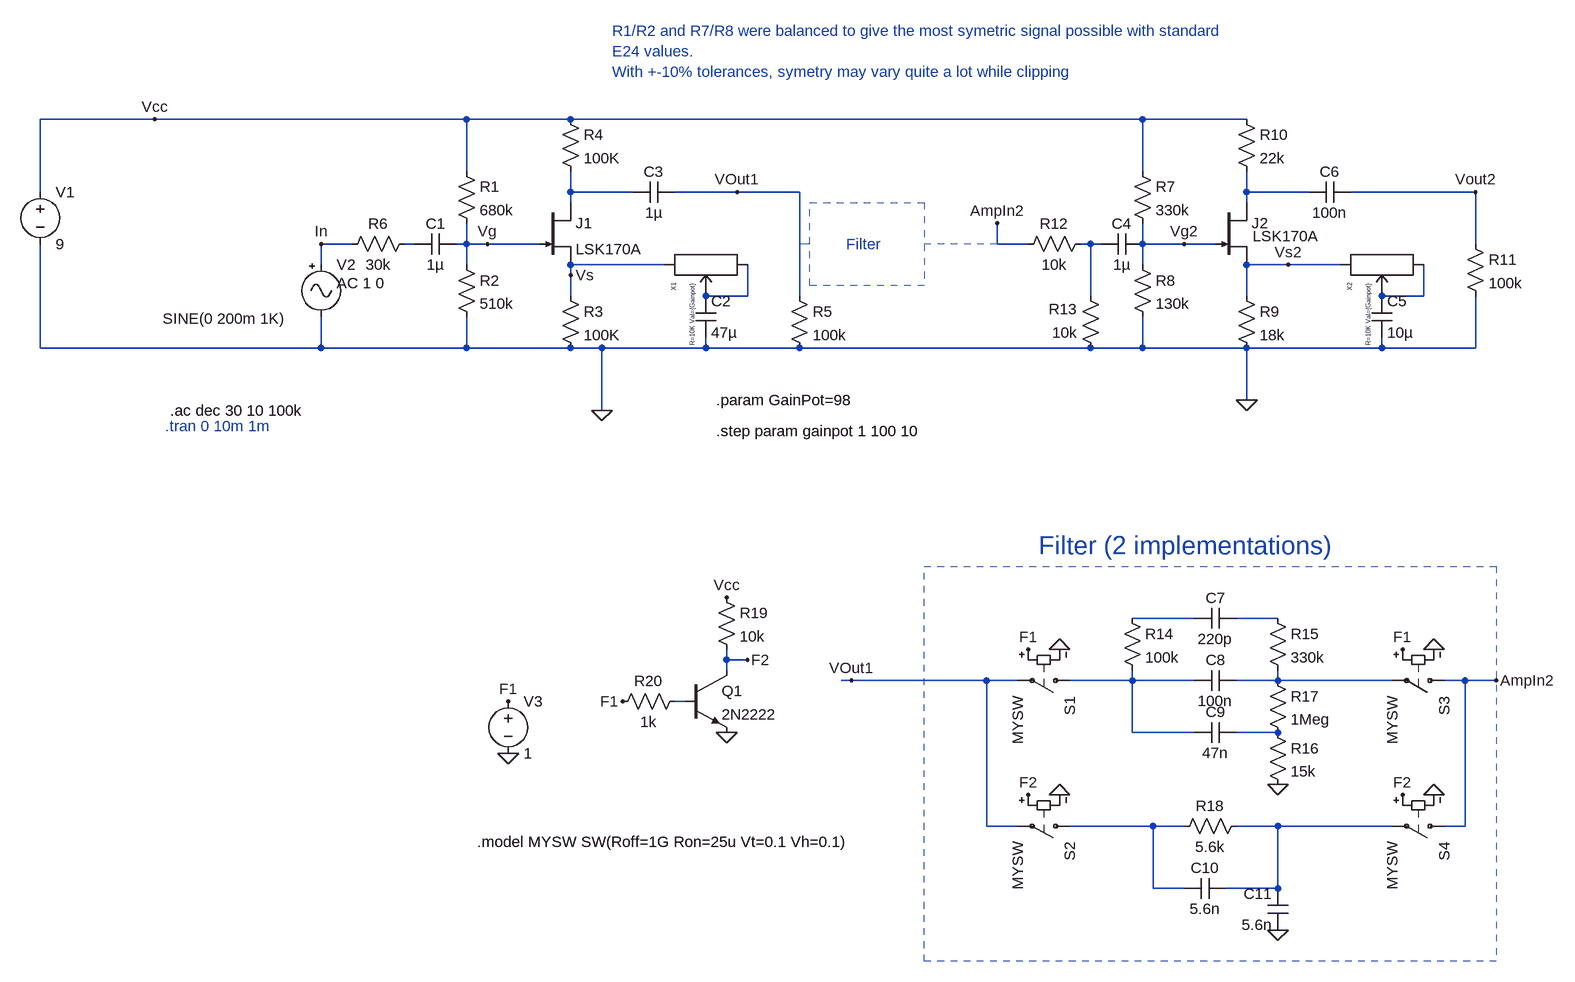
[diagram p0: schematic NJfetCommonSourceAmp.asc]
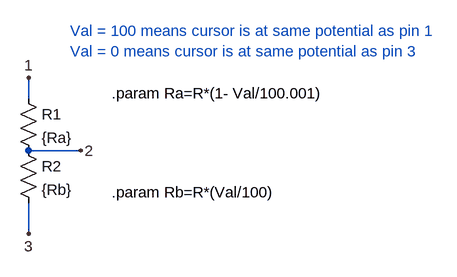
[diagram p1: sub-circuit potentiometer.asc]
NJfetCommonSourceAmp.asc, the LTspice schematic file:
Version 4
SHEET 1 1916 1204
WIRE -256 -96 -432 -96
WIRE 224 -96 -256 -96
WIRE 384 -96 224 -96
WIRE 1264 -96 384 -96
WIRE 1424 -96 1264 -96
WIRE 224 -16 224 -96
WIRE 1264 -16 1264 -96
WIRE -432 16 -432 -96
WIRE 384 16 384 -16
WIRE 480 16 384 16
WIRE 640 16 544 16
WIRE 736 16 640 16
WIRE 1424 16 1424 -16
WIRE 1520 16 1424 16
WIRE 1776 16 1584 16
WIRE 384 32 384 16
WIRE 1424 32 1424 16
WIRE 48 96 0 96
WIRE 144 96 128 96
WIRE 224 96 224 64
WIRE 224 96 208 96
WIRE 256 96 224 96
WIRE 336 96 256 96
WIRE 1040 96 1040 64
WIRE 1088 96 1040 96
WIRE 1184 96 1168 96
WIRE 1200 96 1184 96
WIRE 1264 96 1264 64
WIRE 1328 96 1264 96
WIRE 1376 96 1328 96
WIRE 1776 96 1776 16
WIRE 0 128 0 96
WIRE 224 128 224 96
WIRE 528 128 384 128
WIRE 1264 128 1264 96
WIRE 1488 128 1424 128
WIRE 1568 128 1488 128
WIRE 384 144 384 128
WIRE 384 176 384 144
WIRE 656 176 656 128
WIRE 656 176 592 176
WIRE 736 176 736 16
WIRE 1184 176 1184 96
WIRE 1424 176 1424 128
WIRE 1696 176 1696 128
WIRE 1696 176 1632 176
WIRE -432 256 -432 96
WIRE 0 256 0 208
WIRE 0 256 -432 256
WIRE 224 256 224 208
WIRE 224 256 0 256
WIRE 384 256 224 256
WIRE 432 256 384 256
WIRE 592 256 592 240
WIRE 592 256 432 256
WIRE 736 256 592 256
WIRE 1184 256 736 256
WIRE 1264 256 1264 208
WIRE 1264 256 1184 256
WIRE 1424 256 1264 256
WIRE 1632 256 1632 240
WIRE 1632 256 1424 256
WIRE 1776 256 1776 176
WIRE 1776 256 1632 256
WIRE 1424 336 1424 256
WIRE 432 352 432 256
WIRE 1344 672 1248 672
WIRE 1472 672 1408 672
WIRE 624 736 624 720
WIRE 656 736 624 736
WIRE 624 752 624 736
WIRE 816 768 800 768
WIRE 1024 768 816 768
WIRE 1072 768 1024 768
WIRE 1248 768 1248 752
WIRE 1248 768 1152 768
WIRE 1344 768 1248 768
WIRE 1472 768 1472 752
WIRE 1472 768 1408 768
WIRE 1648 768 1472 768
WIRE 1760 768 1728 768
WIRE 1808 768 1760 768
WIRE 560 800 544 800
WIRE 1248 848 1248 768
WIRE 1344 848 1248 848
WIRE 1472 848 1408 848
WIRE 1024 992 1024 768
WIRE 1072 992 1024 992
WIRE 1280 992 1152 992
WIRE 1328 992 1280 992
WIRE 1472 992 1408 992
WIRE 1648 992 1472 992
WIRE 1760 992 1760 768
WIRE 1760 992 1728 992
WIRE 1280 1088 1280 992
WIRE 1328 1088 1280 1088
WIRE 1472 1088 1472 992
WIRE 1472 1088 1392 1088
FLAG 432 352 0
FLAG 640 16 VOut1
FLAG 256 96 Vg
FLAG 384 144 Vs
FLAG 0 96 In
FLAG 1424 336 0
FLAG 1488 128 Vs2
FLAG 1776 16 Vout2
FLAG 1328 96 Vg2
FLAG -256 -96 Vcc
FLAG 1808 768 AmpIn2
FLAG 1040 64 AmpIn2
FLAG 816 768 VOut1
FLAG 1472 928 0
FLAG 1472 1152 0
FLAG 1136 944 0
FLAG 1136 720 0
FLAG 1712 720 0
FLAG 1712 944 0
FLAG 288 880 0
FLAG 288 800 F1
FLAG 1088 720 F1
FLAG 1664 720 F1
FLAG 1088 944 F2
FLAG 1664 944 F2
FLAG 464 800 F1
FLAG 624 848 0
FLAG 624 640 Vcc
FLAG 656 736 F2
SYMBOL voltage -432 0 R0
WINDOW 123 0 0 Left 0
WINDOW 39 0 0 Left 0
SYMATTR InstName V1
SYMATTR Value 9
SYMBOL Misc\\signal 0 112 R0
WINDOW 3 -244 99 Left 2
WINDOW 123 24 44 Left 2
WINDOW 39 0 0 Left 0
SYMATTR Value SINE(0 200m 1K)
SYMATTR Value2 AC 1 0
SYMATTR InstName V2
SYMBOL njf 336 32 R0
SYMATTR InstName J1
SYMATTR Value LSK170A
SYMBOL cap 208 80 R90
WINDOW 0 0 32 VBottom 2
WINDOW 3 32 32 VTop 2
SYMATTR InstName C1
SYMATTR Value 1µ
SYMBOL res 208 -32 R0
SYMATTR InstName R1
SYMATTR Value 680k
SYMBOL res 208 112 R0
SYMATTR InstName R2
SYMATTR Value 510k
SYMBOL res 368 160 R0
SYMATTR InstName R3
SYMATTR Value 100K
SYMBOL cap 576 176 R0
SYMATTR InstName C2
SYMATTR Value 47µ
SYMBOL res 368 -112 R0
SYMATTR InstName R4
SYMATTR Value 100K
SYMBOL res 144 80 R90
WINDOW 0 0 56 VBottom 2
WINDOW 3 32 56 VTop 2
SYMATTR InstName R6
SYMATTR Value 30k
SYMBOL cap 544 0 R90
WINDOW 0 0 32 VBottom 2
WINDOW 3 32 32 VTop 2
SYMATTR InstName C3
SYMATTR Value 1µ
SYMBOL Potentiometer 592 128 M90
WINDOW 39 28 -21 Left 0
SYMATTR SpiceLine R=10K Val={Gainpot}
SYMATTR InstName X1
SYMBOL njf 1376 32 R0
WINDOW 3 57 52 Left 2
SYMATTR Value LSK170A
SYMATTR InstName J2
SYMBOL res 1248 -32 R0
SYMATTR InstName R7
SYMATTR Value 330k
SYMBOL res 1248 112 R0
SYMATTR InstName R8
SYMATTR Value 130k
SYMBOL res 1408 160 R0
SYMATTR InstName R9
SYMATTR Value 18k
SYMBOL cap 1616 176 R0
SYMATTR InstName C5
SYMATTR Value 10µ
SYMBOL res 1408 -112 R0
SYMATTR InstName R10
SYMATTR Value 22k
SYMBOL cap 1584 0 R90
WINDOW 0 0 32 VBottom 2
WINDOW 3 32 32 VTop 2
SYMATTR InstName C6
SYMATTR Value 100n
SYMBOL res 1760 80 R0
SYMATTR InstName R11
SYMATTR Value 100k
SYMBOL cap 1264 80 R90
WINDOW 0 0 32 VBottom 2
WINDOW 3 32 32 VTop 2
SYMATTR InstName C4
SYMATTR Value 1µ
SYMBOL res 1184 80 R90
WINDOW 0 0 56 VBottom 2
WINDOW 3 32 56 VTop 2
SYMATTR InstName R12
SYMATTR Value 10k
SYMBOL res 1200 272 R180
WINDOW 0 36 76 Left 2
WINDOW 3 36 40 Left 2
SYMATTR InstName R13
SYMATTR Value 10k
SYMBOL Potentiometer 1632 128 M90
WINDOW 39 28 -21 Left 0
SYMATTR SpiceLine R=10K Val={Gainpot}
SYMATTR InstName X2
SYMBOL res 720 160 R0
SYMATTR InstName R5
SYMATTR Value 100k
SYMBOL cap 1408 656 R90
WINDOW 0 0 32 VBottom 2
WINDOW 3 32 32 VTop 2
SYMATTR InstName C7
SYMATTR Value 220p
SYMBOL res 1232 656 R0
SYMATTR InstName R14
SYMATTR Value 100k
SYMBOL res 1456 656 R0
SYMATTR InstName R15
SYMATTR Value 330k
SYMBOL cap 1408 752 R90
WINDOW 0 0 32 VBottom 2
WINDOW 3 32 32 VTop 2
SYMATTR InstName C8
SYMATTR Value 100n
SYMBOL cap 1408 832 R90
WINDOW 0 0 32 VBottom 2
WINDOW 3 32 32 VTop 2
SYMATTR InstName C9
SYMATTR Value 47n
SYMBOL res 1456 832 R0
SYMATTR InstName R16
SYMATTR Value 15k
SYMBOL res 1456 752 R0
SYMATTR InstName R17
SYMATTR Value 1Meg
SYMBOL res 1424 976 R90
WINDOW 0 0 56 VBottom 2
WINDOW 3 32 56 VTop 2
SYMATTR InstName R18
SYMATTR Value 5.6k
SYMBOL cap 1392 1072 R90
WINDOW 0 0 32 VBottom 2
WINDOW 3 32 32 VTop 2
SYMATTR InstName C10
SYMATTR Value 5.6n
SYMBOL cap 1488 1152 R180
WINDOW 0 24 56 Left 2
WINDOW 3 24 8 Left 2
SYMATTR InstName C11
SYMATTR Value 5.6n
SYMBOL sw 1168 768 R90
SYMATTR InstName S1
SYMATTR Value MYSW
SYMBOL sw 1168 992 R90
SYMATTR InstName S2
SYMATTR Value MYSW
SYMBOL sw 1744 768 R90
SYMATTR InstName S3
SYMATTR Value MYSW
SYMBOL sw 1744 992 R90
SYMATTR InstName S4
SYMATTR Value MYSW
SYMBOL voltage 288 784 R0
WINDOW 123 0 0 Left 0
WINDOW 39 0 0 Left 0
SYMATTR InstName V3
SYMATTR Value 1
SYMBOL npn 560 752 R0
SYMATTR InstName Q1
SYMATTR Value 2N2222
SYMBOL res 608 624 R0
SYMATTR InstName R19
SYMATTR Value 10k
SYMBOL res 560 784 R90
WINDOW 0 0 56 VBottom 2
WINDOW 3 32 56 VTop 2
SYMATTR InstName R20
SYMATTR Value 1k
TEXT -240 376 Left 2 ;.tran 0 10m 1m
TEXT 608 336 Left 2 !.param GainPot=98
TEXT 608 384 Left 2 !.step param gainpot 1 100 10
TEXT -232 352 Left 2 !.ac dec 30 10 100k
TEXT 448 -232 Left 2 ;R1/R2 and R7/R8 were balanced to give the most symetric signal possible with standard\nE24 values.\nWith +-10% tolerances, symetry may vary quite a lot while clipping
TEXT 808 96 Left 2 ;Filter
TEXT 1104 560 Left 4 ;Filter (2 implementations)
TEXT 240 1016 Left 2 !.model MYSW SW(Roff=1G Ron=25u Vt=0.1 Vh=0.1)
LINE Normal 752 96 736 96 2
LINE Normal 752 96 752 96 2
LINE Normal 752 96 752 96 2
LINE Normal 1040 96 928 96 2
RECTANGLE Normal 928 160 752 32 2
RECTANGLE Normal 1808 1200 928 592 2

potentiometer.asc, the sub-circuit schematic file:
Version 4
SHEET 1 908 680
WIRE 192 96 192 64
WIRE 272 176 192 176
WIRE 192 304 192 256
FLAG 192 64 1
FLAG 272 176 2
FLAG 192 304 3
SYMBOL res 176 80 R0
SYMATTR InstName R1
SYMATTR Value {Ra}
SYMBOL res 176 160 R0
SYMATTR InstName R2
SYMATTR Value {Rb}
TEXT 320 88 Left 2 !.param Ra=R*(1- Val/100.001)
TEXT 320 240 Left 2 !.param Rb=R*(Val/100)
TEXT 256 -8 Left 2 ;Val = 100 means cursor is at same potential as pin 1\nVal = 0 means cursor is at same potential as pin 3

The netlist it stands for:
* NJfetCommonSourceAmp.asc
V1 Vcc 0 9
V2 In 0 SINE(0 200m 1K) AC 1 0
J1 N001 Vg Vs LSK170A
C1 Vg N003 1µ
R1 Vcc Vg 680k
R2 Vg 0 510k
R3 Vs 0 100K
C2 N005 0 47µ
R4 Vcc N001 100K
R6 N003 In 30k
C3 VOut1 N001 1µ
XX1 Vs N005 N005 potentiometer params: R=10K Val={Gainpot}
J2 N002 Vg2 Vs2 LSK170A
R7 Vcc Vg2 330k
R8 Vg2 0 130k
R9 Vs2 0 18k
C5 N006 0 10µ
R10 Vcc N002 22k
C6 Vout2 N002 100n
R11 Vout2 0 100k
C4 Vg2 N004 1µ
R12 N004 AmpIn2 10k
R13 0 N004 10k
XX2 Vs2 N006 N006 potentiometer params: R=10K Val={Gainpot}
R5 VOut1 0 100k
C7 N008 N007 220p
R14 N007 N009 100k
R15 N008 N010 330k
C8 N010 N009 100n
C9 N012 N009 47n
R16 N012 0 15k
R17 N010 N012 1Meg
R18 N014 N013 5.6k
C10 N014 N013 5.6n
C11 0 N014 5.6n
S1 N009 VOut1 F1 0 MYSW
S2 N013 VOut1 F2 0 MYSW
S3 AmpIn2 N010 F1 0 MYSW
S4 AmpIn2 N014 F2 0 MYSW
V3 F1 0 1
Q1 F2 N011 0 0 2N2222
R19 Vcc F2 10k
R20 N011 F1 1k

* block symbol definitions
.subckt potentiometer 1 2 3
R1 1 2 {Ra}
R2 2 3 {Rb}
.param Ra=R*(1- Val/100.001)
.param Rb=R*(Val/100)
* Val = 100 means cursor is at same potential as pin 1
* Val = 0 means cursor is at same potential as pin 3
.ends potentiometer

.model NPN NPN
.model PNP PNP
.lib standard.bjt
.model NJF NJF
.model PJF PJF
.lib standard.jft
* .tran 0 10m 1m
.param GainPot=98
.step param gainpot 1 100 10
.ac dec 30 10 100k
* R1/R2 and R7/R8 were balanced to give the most symetric signal possible with standard
* E24 values.
* With +-10% tolerances, symetry may vary quite a lot while clipping
* Filter
* Filter (2 implementations)
.model MYSW SW(Roff=1G Ron=25u Vt=0.1 Vh=0.1)
.backanno
.end